# Altium schematic sheet Jade_v1_schematics_PG1_TITLE_PAGE.SchDoc
size A4; Author: Hanxiao; Revision: A0_Alpha; SheetNumber: 1; SheetTotal: 4
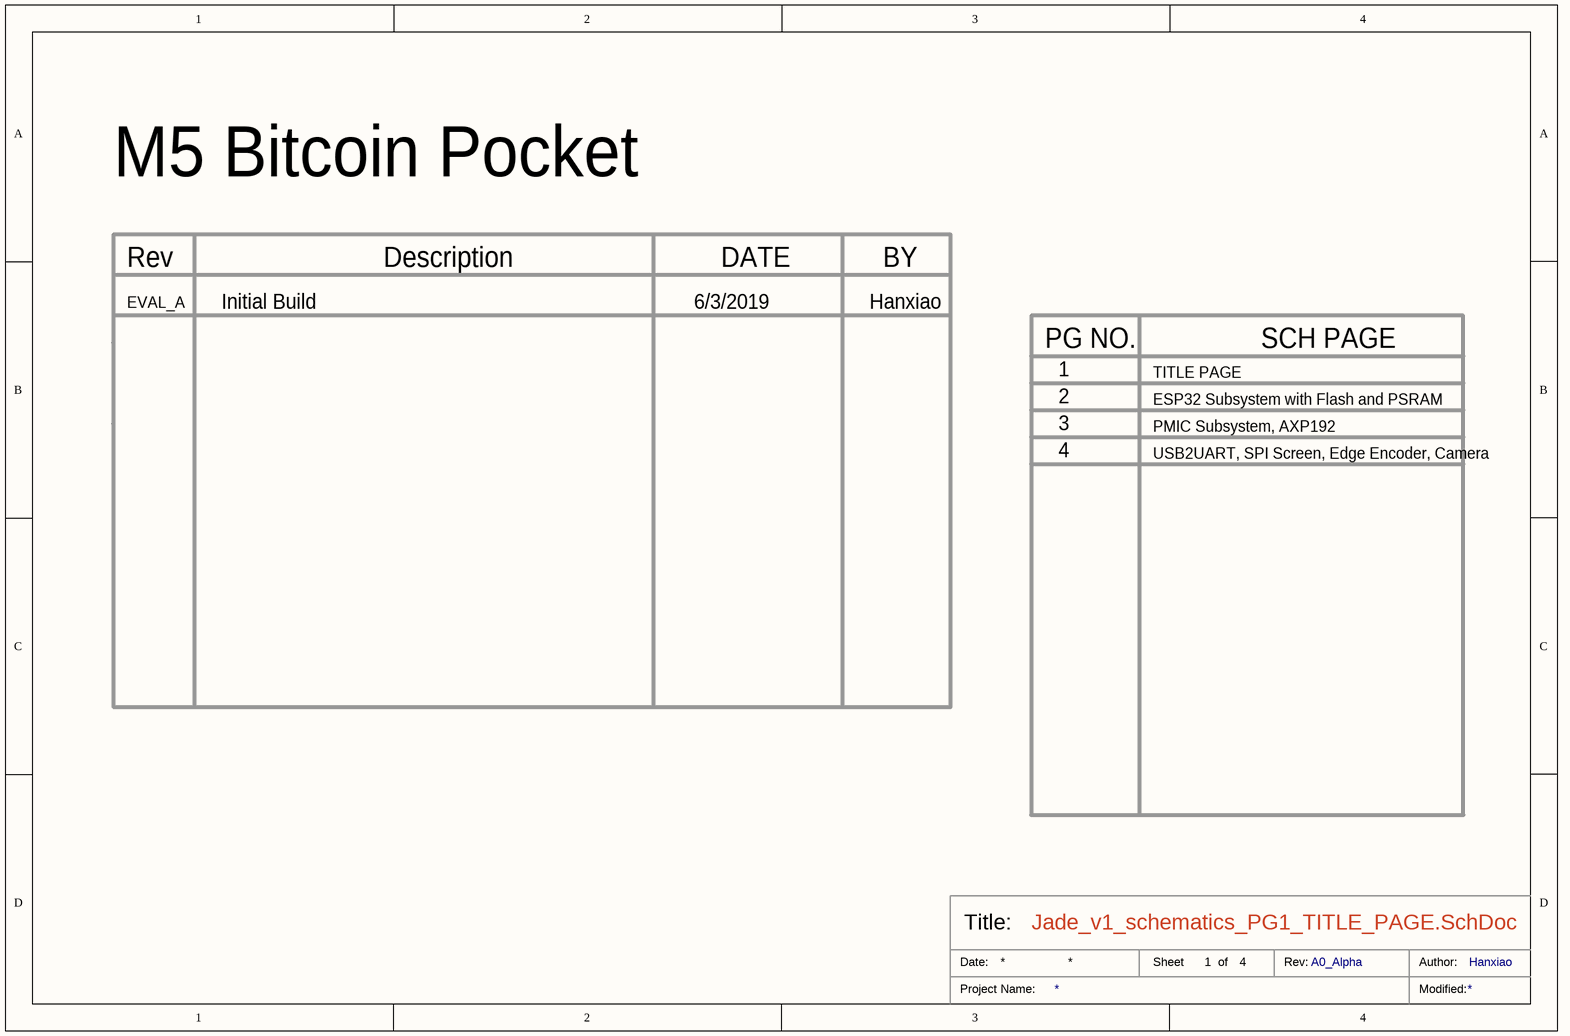
[diagram p0: Jade_v1_schematics_PG1_TITLE_PAGE.SchDoc]

## Notes on the sheet
- M5 Bitcoin Pocket
- Rev
- EVAL_A
- Initial Build
- Description
- 6/3/2019
- DATE
- Hanxiao
- BY
- PG NO.
- 1
- TITLE PAGE
- SCH PAGE
- 2
- 3
- ESP32 Subsystem with Flash and PSRAM
- PMIC Subsystem, AXP192
- 4
- USB2UART, SPI Screen, Edge Encoder, Camera
- Date:
- Title:
- Sheet
- of
- Rev:
- Author:
- Project Name:
- Modified:
- Title
- Size:
- A4
- Number:
- Time:
- Revision:
- File: